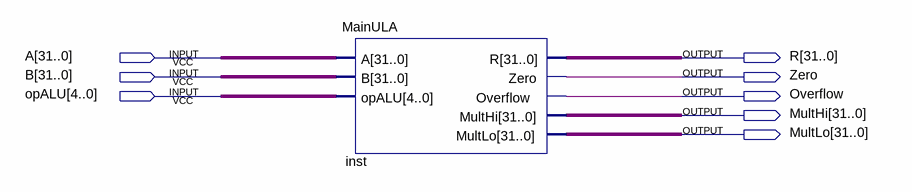
[diagram p0: schematic sheet]
// Quartus schematic TesteMainULA.bdf as structural Verilog: 1 symbols, 8 pins
module TesteMainULA (
  input  [31:0] A,
  input  [31:0] B,
  input  [4:0] opALU,
  output [31:0] R,
  output Zero,
  output Overflow,
  output [31:0] MultHi,
  output [31:0] MultLo
);

  MainULA inst (.A(A), .B(B), .opALU(opALU), .R(R), .Zero(Zero), .Overflow(Overflow), .MultHi(MultHi), .MultLo(MultLo));
endmodule
